# Altium project AC_Output.PrjPcb
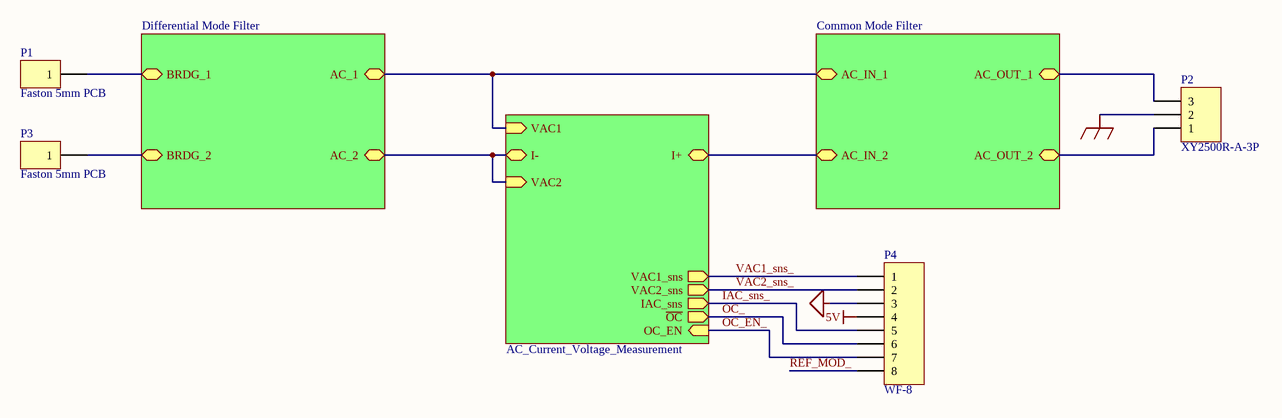
[diagram p0: Main.SchDoc]
4 sheets, 30 parts. Net scope: hierarchical (ports join the sheet entries above them; power ports are global).
Board file: AC_Output.PcbDoc
Sheets:
  Main.SchDoc
    Differential Mode Filter = Differential_Mode_Filter.SchDoc
    Common Mode Filter = Common_Mode_Filter.SchDoc
    AC_Current_Voltage_Measurement = AC_Current_Voltage_Measurement.SchDoc

## Sheet Main.SchDoc: Main
size A4; CompanyName: -; DrawnBy: Naldi, López; Revision: 1; SheetNumber: 1; SheetTotal: 4; Number: 25

### Parts
P1  Faston 5mm PCB  [FASTON 5mm PCB]
P2  XY2500R-A-3P  [XY2500R-A-3P]
P3  Faston 5mm PCB  [FASTON 5mm PCB]
P4  WF-8  [HDR1X8]

### Sub-sheets
AC_Current_Voltage_Measurement = AC_Current_Voltage_Measurement.SchDoc: I+ (bidir), I- (bidir), VAC1_sns (out), VAC2_sns (out), VAC1 (in), ~{OC} (out), IAC_sns (out), OC_EN (in), VAC2 (in)
Common Mode Filter = Common_Mode_Filter.SchDoc: AC_IN_2 (bidir), AC_OUT_1 (bidir), AC_OUT_2 (bidir), AC_IN_1 (bidir)
Differential Mode Filter = Differential_Mode_Filter.SchDoc: BRDG_1 (bidir), BRDG_2 (bidir), AC_1 (bidir), AC_2 (bidir)

### Nets
5V: P4.4
EARTH: P2.2
SGND: P4.3
IAC_sns_: P4.5 ; sheet AC_Current_Voltage_Measurement/IAC_sns
OC_: P4.6 ; sheet AC_Current_Voltage_Measurement/~{OC}
OC_EN_: P4.7 ; sheet AC_Current_Voltage_Measurement/OC_EN
REF_MOD_: P4.8
VAC1_sns_: P4.1 ; sheet AC_Current_Voltage_Measurement/VAC1_sns
VAC2_sns_: P4.2 ; sheet AC_Current_Voltage_Measurement/VAC2_sns
NetC5_2: sheet Differential Mode Filter/AC_1, sheet Common Mode Filter/AC_IN_1, sheet AC_Current_Voltage_Measurement/VAC1
NetC6_1: sheet Common Mode Filter/AC_IN_2, sheet AC_Current_Voltage_Measurement/I+
NetC7_1: P2.1 ; sheet Common Mode Filter/AC_OUT_2
NetC7_2: P2.3 ; sheet Common Mode Filter/AC_OUT_1
NetC9_1: sheet Differential Mode Filter/AC_2, sheet AC_Current_Voltage_Measurement/I-, sheet AC_Current_Voltage_Measurement/VAC2
NetL2_11: P3.1 ; sheet Differential Mode Filter/BRDG_2
NetL2_16: P1.1 ; sheet Differential Mode Filter/BRDG_1

### Notes on the sheet
- Title
- Size:
- Project:
- A4
- Number:
- Revision:
- Sheet
- of
- Drawn by:
- Company:
- File:

### Library data of the parts
P1 P3 = Faston 5mm PCB: System: Connector; LatestRevisionDate: 17-Jul-2002; LatestRevisionNote: Re-released for DXP Platform.; Publisher: Altium Limited
  P1: Parameter 1: *
P2 = XY2500R-A-3P: HEADER 3P 90gra P/CI P=5MM; System: Connector; LatestRevisionDate: 17-Jul-2002; LatestRevisionNote: Re-released for DXP Platform.; Publisher: Altium Limited
P4 = Header 8: Header, 8-Pin; System: Connector; LatestRevisionDate: 17-Jul-2002; LatestRevisionNote: Re-released for DXP Platform.; Publisher: Altium Limited

## Sheet Differential_Mode_Filter.SchDoc: Differential Mode Filter
size A4; CompanyName: -; DrawnBy: Naldi, López; DocumentNumber: 1; Revision: 1; SheetNumber: 2; SheetTotal: 4; Number: 25
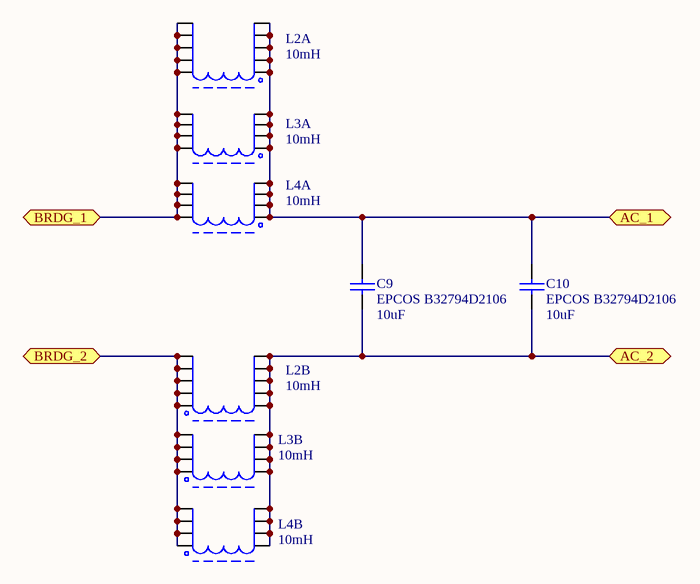
[diagram p1: Differential_Mode_Filter.SchDoc]

### Parts
C9  EPCOS B32794D2106  value 10uF  [MKP AC filtering - 10]
C10  EPCOS B32794D2106  value 10uF  [MKP AC filtering - 10]
L2  value 10mH  [Core_PM_87/70]  (hidden comment: Coupled Inductors)  (parts A,B of 2)
L3  value 10mH  [Core_PM_74/59]  (hidden comment: Coupled Inductors)  (parts A,B of 2)
L4  value 10mH  [Core_PM_62/49]  (hidden comment: Coupled Inductors)  (parts A,B of 2)

### Ports
AC_1 (bidir), AC_2 (bidir), BRDG_1 (bidir), BRDG_2 (bidir)

### Nets
NetC5_2: C9.2 C10.2 L2.1 L2.2 L2.3 L2.4 L2.5 L3.1 L3.2 L3.3 L3.4 L4.1 L4.2 L4.3 L4.4 ; port AC_1
NetC9_1: C9.1 C10.1 L2.6 L2.7 L2.8 L2.9 L2.10 L3.6 L3.7 L3.8 L3.9 L4.5 L4.6 L4.7 L4.8 ; port AC_2
NetL2_11: L2.11 L2.12 L2.13 L2.14 L2.15 L3.10 L3.11 L3.12 L3.13 L4.9 L4.10 L4.11 L4.12 ; port BRDG_2
NetL2_16: L2.16 L2.17 L2.18 L2.19 L2.20 L3.15 L3.16 L3.17 L3.18 L4.13 L4.14 L4.15 L4.16 ; port BRDG_1

### Notes on the sheet
- Title
- Size:
- Project:
- A4
- Number:
- Revision:
- Sheet
- of
- Drawn by:
- Company:
- File:

### Library data of the parts
C9 C10 = EPCOS B32794D2106: MKP AC Filtering 10uF 630Vdc; Published: 8-Jun-2000; LatestRevisionDate: 17-Jul-2002; LatestRevisionNote: Re-released for DXP Platform.; PackageReference: RAD-0.3; Publisher: Altium Limited; PackageDescription: Radial Cap, Thru-Hole; 2 Leads; 0.3 in Pin Spacing
L2 = Inductor 87/70: Coupled Inductors with Ferrite core and Air gap; Code_IEC: 1005; Published: 8-Jun-2000; LatestRevisionDate: 29-May-2009; LatestRevisionNote: IPC-7351 Footprint Added.; PackageReference: 0402-A; Publisher: Altium Limited; PackageDescription: Chip Inductor; Code_JEITA: 0402
L3 = Inductor 74/59: Coupled Inductors with Ferrite core and Air gap; Code_IEC: 1005; Published: 8-Jun-2000; LatestRevisionDate: 29-May-2009; LatestRevisionNote: IPC-7351 Footprint Added.; PackageReference: 0402-A; Publisher: Altium Limited; PackageDescription: Chip Inductor; Code_JEITA: 0402
L4 = Inductor 62/49: Coupled Inductors with Ferrite core and Air gap; Code_IEC: 1005; Published: 8-Jun-2000; LatestRevisionDate: 29-May-2009; LatestRevisionNote: IPC-7351 Footprint Added.; PackageReference: 0402-A; Publisher: Altium Limited; PackageDescription: Chip Inductor; Code_JEITA: 0402

## Sheet Common_Mode_Filter.SchDoc: Common Mode Filter
size A4; CompanyName: -; DrawnBy: Naldi, López; Revision: 1; SheetNumber: 3; SheetTotal: 4; Number: 25
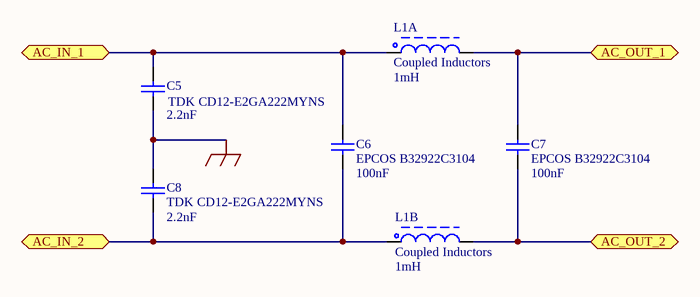
[diagram p2: Common_Mode_Filter.SchDoc]

### Parts
C5  TDK CD12-E2GA222MYNS  value 2.2nF  [SAFETY Y1 type]
C6  EPCOS B32922C3104  value 100nF  [MKP PITCH:15mm SIZE:5mmx18mm]
C7  EPCOS B32922C3104  value 100nF  [MKP PITCH:15mm SIZE:5mmx18mm]
C8  TDK CD12-E2GA222MYNS  value 2.2nF  [SAFETY Y1 type]
L1  Coupled Inductors  value 1mH  [Bourns 8108-RC]  (parts A,B of 2)

### Ports
AC_IN_1 (bidir), AC_IN_2 (bidir), AC_OUT_1 (bidir), AC_OUT_2 (bidir)

### Nets
EARTH: C5.1 C8.1
NetC5_2: C5.2 C6.2 L1.1 ; port AC_IN_1
NetC6_1: C6.1 C8.2 L1.4 ; port AC_IN_2
NetC7_1: C7.1 L1.3 ; port AC_OUT_2
NetC7_2: C7.2 L1.2 ; port AC_OUT_1

### Notes on the sheet
- Title
- Size:
- Project:
- A4
- Number:
- Revision:
- Sheet
- of
- Drawn by:
- Company:
- File:

### Library data of the parts
C5 C8 = TDK CD12-E2GA222MYNS: Safety Standard Certified Ceramic Y1 2.2nF 250Vac; Published: 8-Jun-2000; LatestRevisionDate: 17-Jul-2002; LatestRevisionNote: Re-released for DXP Platform.; PackageReference: RAD-0.3; Publisher: Altium Limited; PackageDescription: Radial Cap, Thru-Hole; 2 Leads; 0.3 in Pin Spacing
C6 C7 = EPCOS B32922C3104: MKP EMI suppression X2 100nF 305Vac; Published: 8-Jun-2000; LatestRevisionDate: 17-Jul-2002; LatestRevisionNote: Re-released for DXP Platform.; PackageReference: RAD-0.3; Publisher: Altium Limited; PackageDescription: Radial Cap, Thru-Hole; 2 Leads; 0.3 in Pin Spacing
L1 = Common mode filter 10A: Bourns Common mode inductor 10A 1mH 8108-RC; Code_IEC: 1005; Published: 8-Jun-2000; LatestRevisionDate: 29-May-2009; LatestRevisionNote: IPC-7351 Footprint Added.; PackageReference: 0402-A; Publisher: Altium Limited; PackageDescription: Chip Inductor; Code_JEITA: 0402

## Sheet AC_Current_Voltage_Measurement.SchDoc: Current - Voltage Measurement
size A4; CompanyName: -; DrawnBy: Naldi, López; Revision: 1; SheetNumber: 4; SheetTotal: 4; Number: 25
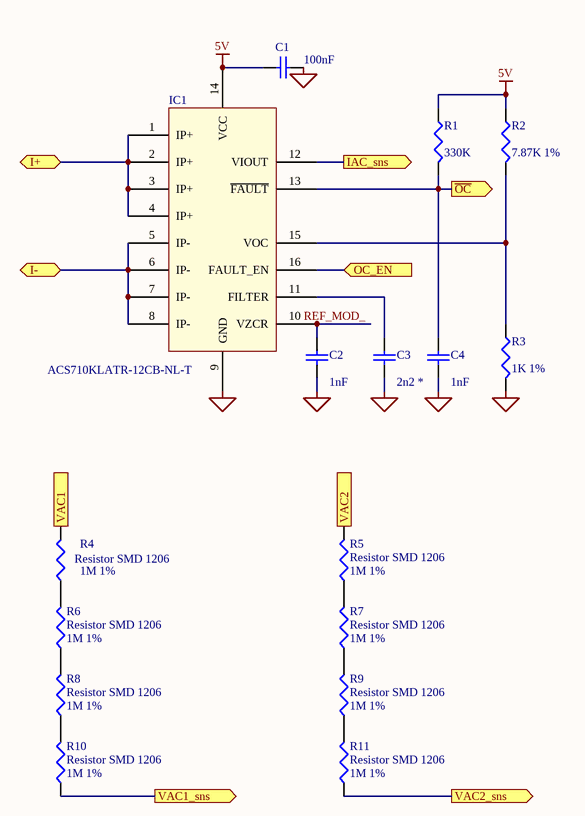
[diagram p3: AC_Current_Voltage_Measurement.SchDoc]

### Parts
C1  value 100nF  [Chip2PinSM127P600-8N]  (hidden comment: EPCOS C2012X7R1H104K)
C2  value 1nF  [Chip2PinSM127P600-8N]  (hidden comment: EPCOS B37940K51102J60)
C3  value 2n2 *  [Chip2PinSM127P600-8N]  (hidden comment: EPCOS B37940)
C4  value 1nF  [Chip2PinSM127P600-8N]  (hidden comment: EPCOS B37940K51102J60)
IC1  ACS710KLATR-12CB-NL-T  [AC710 - SOIC127P600-8N]
R1  value 330K  [Chip2PinSM127P600-8N - 0805]  (hidden comment: Resistor SMD 0805)
R2  value 7.87K 1%  [Chip2PinSM127P600-8N - 0805]  (hidden comment: Resistor SMD 0805)
R3  value 1K 1%  [Chip2PinSM127P600-8N - 0805]  (hidden comment: Resistor SMD 0805)
R4  Resistor SMD 1206  value 1M 1%  [RESC3116X07N - 1206]
R5  Resistor SMD 1206  value 1M 1%  [RESC3116X07N - 1206]
R6  Resistor SMD 1206  value 1M 1%  [RESC3116X07N - 1206]
R7  Resistor SMD 1206  value 1M 1%  [RESC3116X07N - 1206]
R8  Resistor SMD 1206  value 1M 1%  [RESC3116X07N - 1206]
R9  Resistor SMD 1206  value 1M 1%  [RESC3116X07N - 1206]
R10  Resistor SMD 1206  value 1M 1%  [RESC3116X07N - 1206]
R11  Resistor SMD 1206  value 1M 1%  [RESC3116X07N - 1206]

### Ports
I+ (bidir), I- (bidir), IAC_sns (out), OC_EN (in), VAC1 (in), VAC1_sns (out), VAC2 (in), VAC2_sns (out), ~{OC} (out)

### Nets
5V: C1.1 IC1.14(VCC) R1.1 R2.1
SGND: C1.2 C2.1 C3.1 C4.1 IC1.9(GND) R3.2
IAC_sns_: IC1.12(VIOUT) ; port IAC_sns
OC_: C4.2 IC1.13(~{FAULT}) R1.2 ; port ~{OC}
OC_EN_: IC1.16(FAULT_EN) ; port OC_EN
VAC1_sns_: R10.1 ; port VAC1_sns
VAC2_sns_: R11.1 ; port VAC2_sns
NetC2_2: C2.2 IC1.10(VZCR)
NetC3_2: C3.2 IC1.11(FILTER)
NetC5_2: R4.2 ; port VAC1
NetC6_1: IC1.1(IP+) IC1.2(IP+) IC1.3(IP+) IC1.4(IP+) ; port I+
NetC9_1: IC1.5(IP-) IC1.6(IP-) IC1.7(IP-) IC1.8(IP-) R5.2 ; port I-, port VAC2
NetIC1_15: IC1.15(VOC) R2.2 R3.1
NetR4_1: R4.1 R6.2
NetR5_1: R5.1 R7.2
NetR6_1: R6.1 R8.2
NetR7_1: R7.1 R9.2
NetR8_1: R8.1 R10.2
NetR9_1: R9.1 R11.2

### Notes on the sheet
- Labels drawn without touching a wire or pin: REF_MOD_
- Title
- Size:
- Project:
- A4
- Number:
- Revision:
- Sheet
- of
- Drawn by:
- Company:
- File:

### Library data of the parts
C1 = EPCOS C2012X7R1H104K: Ceramic Multilayer 100nF 50Vdc; Published: 8-Jun-2000; LatestRevisionDate: 17-Jul-2002; LatestRevisionNote: Re-released for DXP Platform.; PackageReference: RAD-0.3; Publisher: Altium Limited; PackageDescription: Radial Cap, Thru-Hole; 2 Leads; 0.3 in Pin Spacing
C2 C4 = EPCOS B37940K51102J60: Ceramic Multilayer 1nF 50Vdc COG; Published: 8-Jun-2000; LatestRevisionDate: 17-Jul-2002; LatestRevisionNote: Re-released for DXP Platform.; PackageReference: RAD-0.3; Publisher: Altium Limited; PackageDescription: Radial Cap, Thru-Hole; 2 Leads; 0.3 in Pin Spacing
C3 = EPCOS B37940K51102J60: Ceramic Multilayer 50Vdc COG; Published: 8-Jun-2000; LatestRevisionDate: 17-Jul-2002; LatestRevisionNote: Re-released for DXP Platform.; PackageReference: RAD-0.3; Publisher: Altium Limited; PackageDescription: Radial Cap, Thru-Hole; 2 Leads; 0.3 in Pin Spacing
IC1 = ACS710: Hall Effect Current Sensor
R1-R3 = Resistor SMD 0805: Published: 8-Jun-2000; LatestRevisionDate: 29-May-2009; LatestRevisionNote: IPC-7351 Footprint Added.; PackageReference: J1-0603; Publisher: Altium Limited; PackageDescription: Chip Resistor
R4-R11 = Resistor SMD 1206: Published: 8-Jun-2000; LatestRevisionDate: 29-May-2009; LatestRevisionNote: IPC-7351 Footprint Added.; PackageReference: J1-0603; Publisher: Altium Limited; PackageDescription: Chip Resistor

## Nets that join several sheets
5V: Main (P4.4), AC_Current_Voltage_Measurement (C1.1 IC1.14 R1.1 R2.1)
EARTH: Main (P2.2), Common_Mode_Filter (C5.1 C8.1)
SGND: Main (P4.3), AC_Current_Voltage_Measurement (6 pins)
IAC_sns_: Main (P4.5), AC_Current_Voltage_Measurement (IC1.12)
NetC5_2: Differential_Mode_Filter (15 pins), Common_Mode_Filter (C5.2 C6.2 L1.1), AC_Current_Voltage_Measurement (R4.2)
NetC6_1: Common_Mode_Filter (C6.1 C8.2 L1.4), AC_Current_Voltage_Measurement (IC1.1 IC1.2 IC1.3 IC1.4)
NetC7_1: Main (P2.1), Common_Mode_Filter (C7.1 L1.3)
NetC7_2: Main (P2.3), Common_Mode_Filter (C7.2 L1.2)
NetC9_1: Differential_Mode_Filter (15 pins), AC_Current_Voltage_Measurement (5 pins)
NetL2_11: Main (P3.1), Differential_Mode_Filter (13 pins)
NetL2_16: Main (P1.1), Differential_Mode_Filter (13 pins)
OC_: Main (P4.6), AC_Current_Voltage_Measurement (C4.2 IC1.13 R1.2)
OC_EN_: Main (P4.7), AC_Current_Voltage_Measurement (IC1.16)
VAC1_sns_: Main (P4.1), AC_Current_Voltage_Measurement (R10.1)
VAC2_sns_: Main (P4.2), AC_Current_Voltage_Measurement (R11.1)